# EAGLE schematic BATT_INPUT_TEST_BED_V2 (EAGLE 9.6.2)
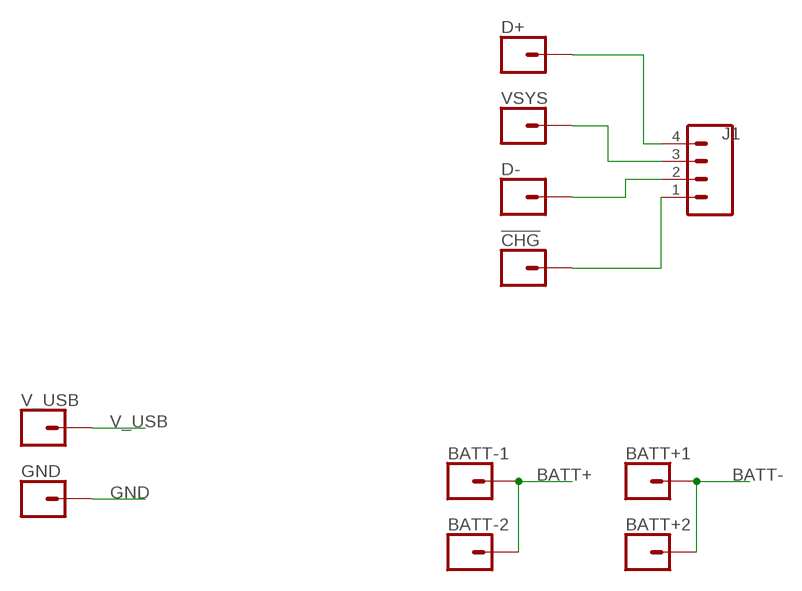
[diagram p0: schematic, sheet 1]

## Parts
!CHG!  CONN_01POGOPIN_HOLE_LARGE  [1X01_POGOPIN_HOLE_0.061_DIA]
BATT+1  CONN_01POGOPIN_HOLE_LARGE  [1X01_POGOPIN_HOLE_0.061_DIA]
BATT+2  CONN_01POGOPIN_HOLE_LARGE  [1X01_POGOPIN_HOLE_0.061_DIA]
BATT-1  CONN_01POGOPIN_HOLE_LARGE  [1X01_POGOPIN_HOLE_0.061_DIA]
BATT-2  CONN_01POGOPIN_HOLE_LARGE  [1X01_POGOPIN_HOLE_0.061_DIA]
D+  CONN_01POGOPIN_HOLE_LARGE  [1X01_POGOPIN_HOLE_0.061_DIA]
D-  CONN_01POGOPIN_HOLE_LARGE  [1X01_POGOPIN_HOLE_0.061_DIA]
GND  CONN_01POGOPIN_HOLE_LARGE  [1X01_POGOPIN_HOLE_0.061_DIA]
J1  FEMALE 2x3  CONN_04  [1X04]
V_USB  CONN_01POGOPIN_HOLE_LARGE  [1X01_POGOPIN_HOLE_0.061_DIA]
VSYS  CONN_01POGOPIN_HOLE_LARGE  [1X01_POGOPIN_HOLE_0.061_DIA]

## Nets
BATT+: BATT-1.2 BATT-2.2
BATT-: BATT+1.2 BATT+2.2
GND: GND.2
N$1: J1.3 VSYS.2
N$2: D+.2 J1.4
N$3: !CHG!.2 J1.1
N$4: D-.2 J1.2
V_USB: V_USB.2

## Library data of the parts
!CHG! BATT+1 BATT+2 BATT-1 BATT-2 D+ D- GND V_USB VSYS = SparkFun-Connectors:CONN_01: Single connection point. Often used as Generic Header-pin footprint for 0.1 inch spaced/style header connections On any of the 0.1 inch spaced packages, you can populate with these: Break Away Headers - Straight <https://www.sparkfun.com/products/116> (PRT-00116) Break Away Male Headers - Right Angle <https://www.sparkfun.com/products/553> (PRT-00553) Female Headers <https://www.sparkfun.com/products/115> (PRT-00115) Break Away Headers - Machine Pin <https://www.sparkfun.com/products/117> (PRT-00117) Break Away Female Headers - Swiss Machine Pin <https://www.sparkfun.com/products/743> (PRT-00743) This device is also useful as a general connection point to wire up your design to another part of your project. Our various solder wires solder well into these plated through hole pads. Hook-Up Wire - Assortment (Stranded, 22 AWG) <https://www.sparkfun.com/products/11375> (PRT-11375) Hook-Up Wire - Assortment (Solid Core, 22 AWG) <https://www.sparkfun.com/products/11367> (PRT-11367) View the entire wire category on our website here <https://www.sparkfun.com/categories/141> Special notes: SMTSO-256-ET is a "flush mount" nut for a 4-40 screw. We mostly use this on specialty testbeds; it is a nice way to connect hardware to your PCB at an adjustable hieght. Also note, the SNAP packages are for using a snappable style connector. We sell a baggie of snaps and they are also used on two LilyPad designs: Snap Assortment - 30 pack (male and female) <https://www.sparkfun.com/products/11347> (DEV-11347) LilyPad Arduino SimpleSnap <https://www.sparkfun.com/products/10941> (DEV-10941) LilyPad SimpleSnap Protoboard <https://www.sparkfun.com/products/10940> (DEV-10940)
J1 = SparkFun-Connectors:CONN_04: Multi connection point. Often used as Generic Header-pin footprint for 0.1 inch spaced/style header connections On any of the 0.1 inch spaced packages, you can populate with these: Break Away Headers - Straight <https://www.sparkfun.com/products/116> (PRT-00116) Break Away Male Headers - Right Angle <https://www.sparkfun.com/products/553> (PRT-00553) Female Headers <https://www.sparkfun.com/products/115> (PRT-00115) Break Away Headers - Machine Pin <https://www.sparkfun.com/products/117> (PRT-00117) Break Away Female Headers - Swiss Machine Pin <https://www.sparkfun.com/products/743> (PRT-00743) For SCREWTERMINALS and SPRING TERMINALS visit here: Screw Terimnals on SparkFun.com <https://www.sparkfun.com/search/results?term=Screw+Terminals> (5mm/3.5mm/2.54mm spacing) This device is also useful as a general connection point to wire up your design to another part of your project. Our various solder wires solder well into these plated through hole pads. Hook-Up Wire - Assortment (Stranded, 22 AWG) <https://www.sparkfun.com/products/11375> (PRT-11375) Hook-Up Wire - Assortment (Solid Core, 22 AWG) <https://www.sparkfun.com/products/11367> (PRT-11367) View the entire wire category on our website here <https://www.sparkfun.com/categories/141> Special notes: Molex polarized connector foot print use with SKU : PRT-08231 with associated crimp pins and housings. 1MM SMD Version SKU: PRT-10208; PROD_ID: CONN-09696

## Net classes
1 power: width 0.178 mm
2 gnd: width 0.305 mm, drill 0.483 mm, clearance 0.203 mm